# EAGLE design main board ver.1 (EAGLE 6.3)
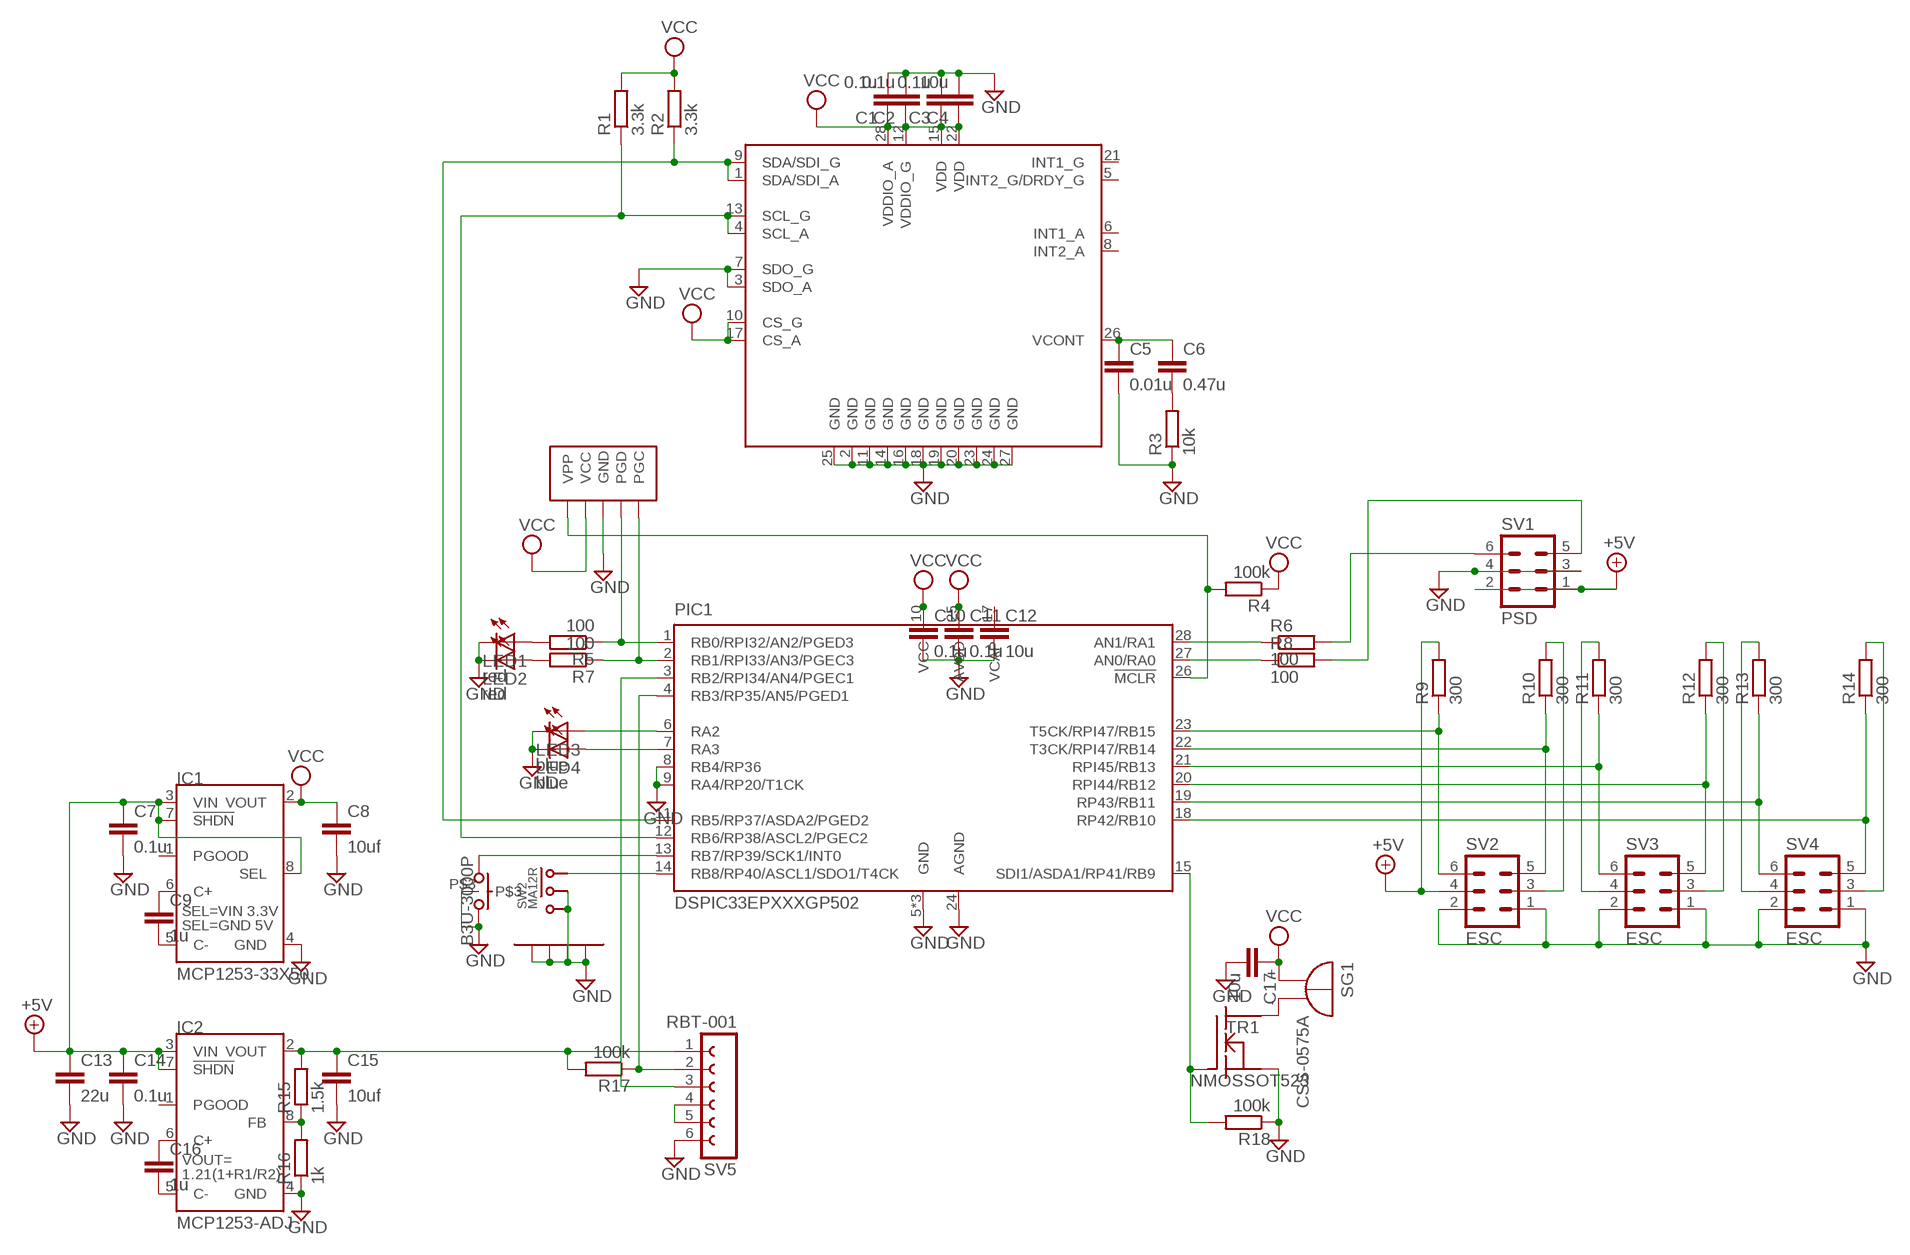
[diagram p0: schematic, sheet 1]

## Parts
C1  0.1u  C-EUC0402-SS  [C0402-SS]
C2  0.1u  C-EUC0402-SS  [C0402-SS]
C3  0.1u  C-EUC0402-SS  [C0402-SS]
C4  10u  C-EUC0805  [C0805]
C5  0.01u  C-EUC0402-SS  [C0402-SS]
C6  0.47u  C-EUC0402-SS  [C0402-SS]
C7  0.1u  C-EUC0402-SS  [C0402-SS]
C8  10uf  C-EUC0805  [C0805]
C9  1u  C-EUC0603  [C0603]
C10  0.1u  C-EUC0402-SS  [C0402-SS]
C11  0.1u  C-EUC0402-SS  [C0402-SS]
C12  10u  C-EUC0805  [C0805]
C13  22u  C-EUC1206  [C1206]
C14  0.1u  C-EUC0402-SS  [C0402-SS]
C15  10uf  C-EUC0805  [C0805]
C16  1u  C-EUC0603  [C0603]
C17  10u  C-EUC0805  [C0805]
IC1  MCP1253-33X50  [MSOP8]
IC2  MCP1253-ADJ  [MSOP8]
IMU1  LSM330DLRM  [LLGA28L(RM)]
LED1  red  LED1005  [CHIP-LED1005]
LED2  red  LED1005  [CHIP-LED1005]
LED3  blue  LED1005  [CHIP-LED1005]
LED4  blue  LED1005  [CHIP-LED1005]
PIC1  DSPIC33EPXXXGP502  [QFN28-ML_6X6MM]
R1  3.3k  R-EU_R0402-SS  [R0402-SS]
R2  3.3k  R-EU_R0402-SS  [R0402-SS]
R3  10k  R-EU_R0402-SS  [R0402-SS]
R4  100k  R-EU_R0402-SS  [R0402-SS]
R5  100  R-EU_R0402-SS  [R0402-SS]
R6  100  R-EU_R0402-SS  [R0402-SS]
R7  100  R-EU_R0402-SS  [R0402-SS]
R8  100  R-EU_R0402-SS  [R0402-SS]
R9  300  R-EU_R0402-SS  [R0402-SS]
R10  300  R-EU_R0402-SS  [R0402-SS]
R11  300  R-EU_R0402-SS  [R0402-SS]
R12  300  R-EU_R0402-SS  [R0402-SS]
R13  300  R-EU_R0402-SS  [R0402-SS]
R14  300  R-EU_R0402-SS  [R0402-SS]
R15  1.5k  R-EU_R0402-SS  [R0402-SS]
R16  1k  R-EU_R0402-SS  [R0402-SS]
R17  100k  R-EU_R0402-SS  [R0402-SS]
R18  100k  R-EU_R0402-SS  [R0402-SS]
SG1  CSS-0575A  [CSS-0575A]
SV1  PSD  MA03-2  [MA03-2]
SV2  ESC  MA03-2  [MA03-2]
SV3  ESC  MA03-2  [MA03-2]
SV4  ESC  MA03-2  [MA03-2]
SV5  RBT-001  FE06-1BFLC  [NPPN061BFLC]
SW1  B3U-3000P  [B3U-3000P]
SW2  MA12R  [MA12R]
TR1  NMOSSOT523  [SOT523]
U$1  ICSP  [MINI-ICSP]

## Nets
+5V: C7.1 C13.1 C14.1 IC1.3(VIN) IC1.7(!SHDN!) IC1.8(SEL) IC2.3(VIN) IC2.7(!SHDN!) R9.2 SV1.1 SV1.2 SV2.4
GND: C1.2 C2.2 C3.2 C4.2 C5.2 C7.2 C8.2 C10.2 C11.2 C12.2 C13.2 C14.2 C15.2 C17.2 IC1.4(GND) IC2.4(GND) IMU1.2(GND) IMU1.3(SDO_A) IMU1.7(SDO_G) IMU1.11(GND) IMU1.14(GND) IMU1.16(GND) IMU1.18(GND) IMU1.19(GND) IMU1.20(GND) IMU1.23(GND) IMU1.24(GND) IMU1.25(GND) IMU1.27(GND) LED1.C LED2.C LED3.C LED4.C PIC1.5(GND) PIC1.8(RB4/RP36) PIC1.9(RA4/RP20/T1CK) PIC1.16(GND) PIC1.24(AGND) PIC1.EXP(GND) R3.1 R16.1 R18.1 SV1.3 SV1.4 SV2.1 SV2.2 SV3.1 SV3.2 SV4.1 SV4.2 SV5.6 SW1.P$2 SW1.P$3 SW2.P$2 SW2.P$3 SW2.P$4 SW2.P$5 SW2.P$6 SW2.P$7 TR1.2(S) U$1.GND
N$2: C16.1 IC2.6(C+)
N$3: C16.2 IC2.5(C-)
N$4: PIC1.28(AN1/RA1) R6.1
N$5: PIC1.27(AN0/RA0) R8.1
N$6: C15.1 IC2.2(VOUT) R15.2 R17.2 SV5.1
N$7: IC2.8(FB) R15.1 R16.2
N$8: R8.2 SV1.5
N$9: C12.1 PIC1.17(VCAP)
N$10: PIC1.18(RP42/RB10) R14.1 SV4.5
N$11: C5.1 C6.1 IMU1.26(VCONT)
N$12: C6.2 R3.2
N$13: PIC1.19(RP43/RB11) R13.1 SV4.6
N$14: PIC1.20(RPI44/RB12) R12.1 SV3.5
N$15: IMU1.1(SDA/SDI_A) IMU1.9(SDA/SDI_G) PIC1.11(RB5/RP37/ASDA2/PGED2) R2.1
N$16: SG1.- TR1.3(D)
N$17: LED4.A PIC1.7(RA3)
N$18: PIC1.21(RPI45/RB13) R11.1 SV3.6
N$19: PIC1.22(T3CK/RPI47/RB14) R10.1 SV2.5
N$20: PIC1.23(T5CK/RPI47/RB15) R9.1 SV2.6
N$21: IMU1.4(SCL_A) IMU1.13(SCL_G) PIC1.12(RB6/RP38/ASCL2/PGEC2) R1.1
N$22: PIC1.15(SDI1/ASDA1/RP41/RB9) R18.2 TR1.1(G)
N$23: LED3.A PIC1.6(RA2)
N$24: LED1.A R5.2
N$25: PIC1.1(RB0/RPI32/AN2/PGED3) R5.1 U$1.PGD
N$26: PIC1.2(RB1/RPI33/AN3/PGEC3) R7.1 U$1.PGC
N$27: PIC1.3(RB2/RPI34/AN4/PGEC1) SV5.3
N$28: PIC1.4(RB3/RP35/AN5/PGED1) R17.1 SV5.2
N$29: LED2.A R7.2
N$30: PIC1.14(RB8/RP40/ASCL1/SDO1/T4CK) SW2.P$1
N$31: PIC1.13(RB7/RP39/SCK1/INT0) SW1.P$1
N$33: PIC1.26(!MCLR!) R4.2 U$1.VPP
N$35: R6.2 SV1.6
N$37: SV5.4 SV5.5
N$39: C9.1 IC1.6(C+)
N$40: C9.2 IC1.5(C-)
N$67: R10.2 SV2.3
N$68: R11.2 SV3.4
N$69: R12.2 SV3.3
N$70: R13.2 SV4.4
N$71: R14.2 SV4.3
VCC: C1.1 C2.1 C3.1 C4.1 C8.1 C10.1 C11.1 C17.1 IC1.2(VOUT) IMU1.10(CS_G) IMU1.12(VDDIO_G) IMU1.15(VDD) IMU1.17(CS_A) IMU1.22(VDD) IMU1.28(VDDIO_A) PIC1.10(VCC) PIC1.25(AVDD) R1.2 R2.2 R4.1 SG1.+ U$1.VCC
Unconnected: IC1.1(PGOOD) IC2.1(PGOOD) IMU1.5(INT2_G/DRDY_G) IMU1.6(INT1_A) IMU1.8(INT2_A) IMU1.21(INT1_G)

## Library data of the parts
C1-C17 = 2 RCL:C-EU: CAPACITOR, European symbol
IC1 = 0 my parts:MCP1253-33X50
IC2 = 0 my parts:MCP1253-ADJ
IMU1 = 0 my parts:LSM330DL
LED1-LED4 = 0 my parts:LED: LED OSRAM: - CHIPLED LG R971, LG N971, LY N971, LG Q971, LY Q971, LO R971, LY R971 LH N974, LH R974 LS Q976, LO Q976, LY Q976 LO Q996 - Hyper CHIPLED LW Q18S LB Q993, LB Q99A, LB R99A - SideLED LS A670, LO A670, LY A670, LG A670, LP A670 LB A673, LV A673, LT A673, LW A673 LH A674 LY A675 LS A676, LA A676, LO A676, LY A676, LW A676 LS A679, LY A679, LG A679 - Hyper Micro SIDELED® LS Y876, LA Y876, LO Y876, LY Y876 LT Y87S - SmartLED LW L88C, LW L88S LB L89C, LB L89S, LG L890 LS L89K, LO L89K, LY L89K LS L896, LA L896, LO L896, LY L896 - TOPLED LS T670, LO T670, LY T670, LG T670, LP T670 LSG T670, LSP T670, LSY T670, LOP T670, LYG T670 LG T671, LOG T671, LSG T671 LB T673, LV T673, LT T673, LW T673 LH T674 LS T676, LA T676, LO T676, LY T676, LB T676, LH T676, LSB T676, LW T676 LB T67C, LV T67C, LT T67C, LS T67K, LO T67K, LY T67K, LW E67C LS E67B, LA E67B, LO E67B, LY E67B, LB E67C, LV E67C, LT E67C LW T67C LS T679, LY T679, LG T679 LS T770, LO T770, LY T770, LG T770, LP T770 LB T773, LV T773, LT T773, LW T773 LH T774 LS E675, LA E675, LY E675, LS T675 LS T776, LA T776, LO T776, LY T776, LB T776 LHGB T686 LT T68C, LB T68C - Hyper Mini TOPLED® LB M676 - Mini TOPLED Santana® LG M470 LS M47K, LO M47K, LY M47K Source: http://www.osram.convergy.de - LUMILED® LXK2-PW12-R00, LXK2-PW12-S00, LXK2-PW14-U00, LXK2-PW14-V00 LXK2-PM12-R00, LXK2-PM12-S00, LXK2-PM14-U00 LXK2-PE12-Q00, LXK2-PE12-R00, LXK2-PE12-S00, LXK2-PE14-T00, LXK2-PE14-U00 LXK2-PB12-K00, LXK2-PB12-L00, LXK2-PB12-M00, LXK2-PB14-N00, LXK2-PB14-P00, LXK2-PB14-Q00 LXK2-PR12-L00, LXK2-PR12-M00, LXK2-PR14-Q00, LXK2-PR14-R00 LXK2-PD12-Q00, LXK2-PD12-R00, LXK2-PD12-S00 LXK2-PH12-R00, LXK2-PH12-S00 LXK2-PL12-P00, LXK2-PL12-Q00, LXK2-PL12-R00 Source: www.luxeon.com
PIC1 = 0 my parts:DSPIC33EPXXXGP502
R1-R18 = 2 RCL:R-EU_: RESISTOR, European symbol
SG1 = 8 BUZZER:CSS-0575A
SV1-SV4 = 4 _l__l_:MA03-2: PIN HEADER
SV5 = 4 _ll_ll_:FE06-1: FEMALE HEADER
SW1 = 0 my parts:B3U
SW2 = 0 my parts:MA12R
TR1 = 0 my parts:NMOS
U$1 = 0 my parts:ICSP

## Board
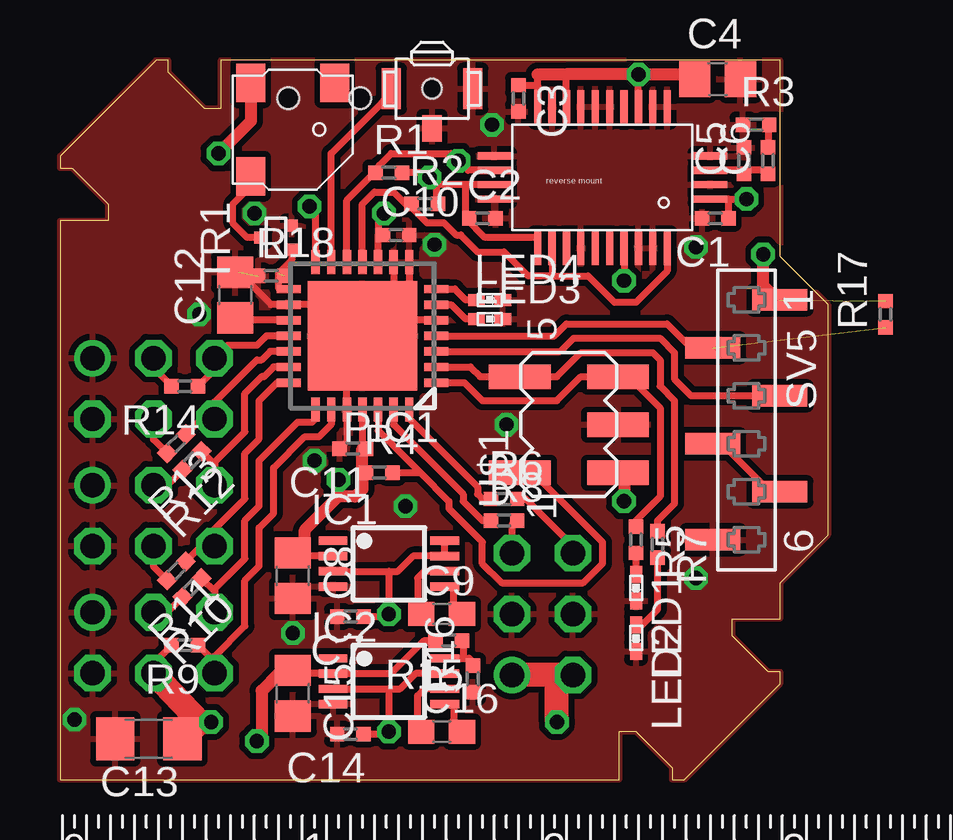
[diagram p1: board, top side]
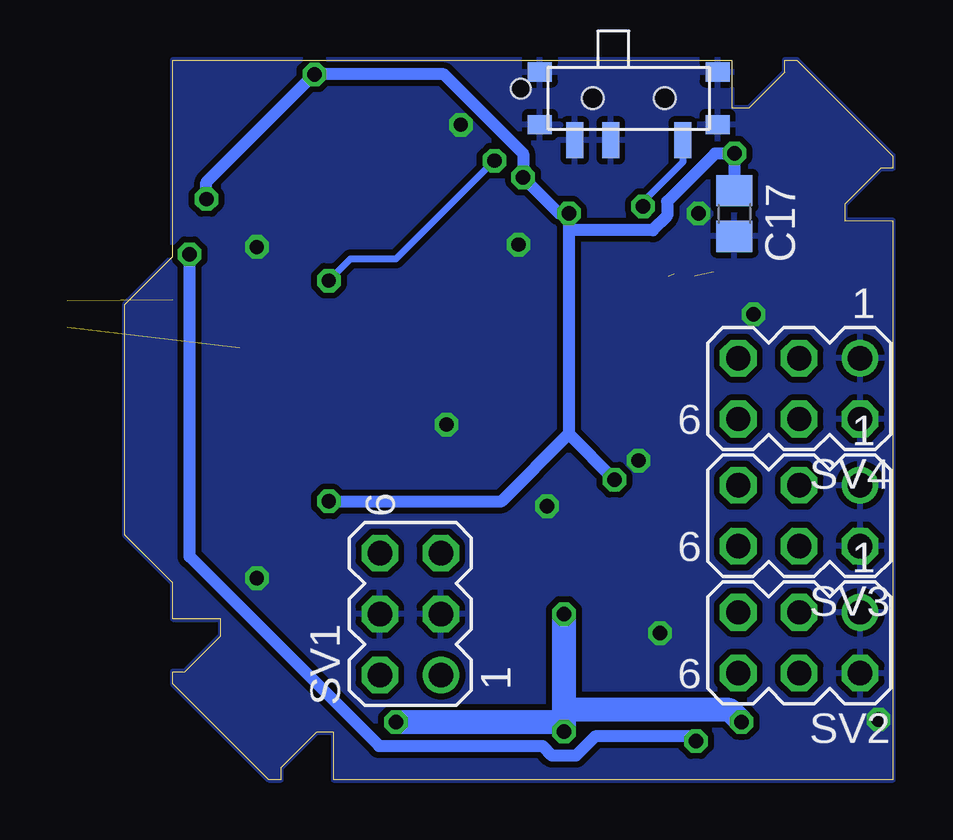
[diagram p2: board, bottom side, seen from below]

Size 32 x 30 mm. Coordinates in mm from the lower left corner, seen from the top.
Outline: 0,0 23.3,0 23.3,2 24,2 25.5,0.5 25.5,0 26,0 30,4 30,4.5 29.5,4.5 28,6 28,6.7 30,6.7 30,8.2 32,10.2 32,19.8 30,21.8 30,30 6.7,30 6.7,28 6,28 4.5,29.5 4.5,30 4,30 0,26 0,25.5 0.5,25.5 2,24 2,23.3 0,23.3 0,0
Copper layers (1*16): Top 0.035mm / dielectric 1.5mm / Bottom 0.035mm
Design rules "default": minimum track width 0.25mm, minimum drill 0.6mm, track to track 0.25mm, track to pad 0.25mm, pad to pad 0.25mm, via to via 0.25mm, smd to smd 0mil, copper to edge 0mil, drill to drill 8mil, minimum pad ring 10mil, minimum via ring 0.19mm, stop-mask expansion 4mil, vias tented up to drill 0mil, thermal gap 10mil

### Footprints (pad centres in the part's own frame; a part is rotated, then mirrored left to right if it is on the bottom)
C0402-SS = smd 0.6 x 0.6: 1 -0.55,0; 2 0.55,0
C0805 = smd 1.3 x 1.5: 1 -0.95,0; 2 0.95,0
C0603 = smd 1.1 x 1: 1 -0.85,0; 2 0.85,0
C1206 = smd 1.6 x 1.8: 1 -1.4,0; 2 1.4,0
MSOP8 = smd 0.35 x 1.2: 1 -0.953,-2.325; 2 -0.318,-2.325; 3 0.318,-2.325; 4 0.953,-2.325; 5 0.953,2.325; 6 0.318,2.325; 7 -0.318,2.325; 8 -0.953,2.325
LLGA28L(RM) = smd 0.3 x 1.4: 1 -2.7,2.95; 2 -2.1,2.95; 3 -1.5,2.95; 4 -0.9,2.95; 5 -0.3,2.95; 6 0.3,2.95; 7 0.9,2.95; 8 1.5,2.95; 9 2.1,2.95; 10 2.7,2.95; 15 2.7,-2.95; 16 2.1,-2.95; 17 1.5,-2.95; 18 0.9,-2.95; 19 0.3,-2.95; 20 -0.3,-2.95; 21 -0.9,-2.95; 22 -1.5,-2.95; 23 -2.1,-2.95; 24 -2.7,-2.95 | smd 1.4 x 0.3: 11 4.5,0.9; 12 4.5,0.3; 13 4.5,-0.3; 14 4.5,-0.9; 25 -4.5,-0.9; 26 -4.5,-0.3; 27 -4.5,0.3; 28 -4.5,0.9
CHIP-LED1005 = smd 0.5 x 0.7: A 0,-0.55; C 0,0.55
QFN28-ML_6X6MM = smd 1 x 0.35: 1 -3.075,1.95; 2 -3.075,1.3; 3 -3.075,0.65; 4 -3.075,0; 5 -3.075,-0.65; 6 -3.075,-1.3; 7 -3.075,-1.95; 15 3.075,-1.95; 16 3.075,-1.3; 17 3.075,-0.65; 18 3.075,0; 19 3.075,0.65; 20 3.075,1.3; 21 3.075,1.95 | smd 0.35 x 1: 8 -1.95,-3.075; 9 -1.3,-3.075; 10 -0.65,-3.075; 11 0,-3.075; 12 0.65,-3.075; 13 1.3,-3.075; 14 1.95,-3.075; 22 1.95,3.075; 23 1.3,3.075; 24 0.65,3.075; 25 0,3.075; 26 -0.65,3.075; 27 -1.3,3.075; 28 -1.95,3.075 | smd 4.55 x 4.55: EXP 0,0
R0402-SS = smd 0.6 x 0.6: 1 -0.55,0; 2 0.55,0
CSS-0575A = smd 1.6 x 1.2: + -1.95,-1.75; - 1.95,-1.75; NC -1.95,1.75
MA03-2 = drill 1.016: 1 -2.54,-1.27 | drill 1.016 octagon: 2 -2.54,1.27; 3 0,-1.27; 4 0,1.27; 5 2.54,-1.27; 6 2.54,1.27
NPPN061BFLC = smd 0.89 x 2.29: 1 -5,1.395; 2 -3,-1.395; 3 -1,1.395; 4 1,-1.395; 5 3,1.395; 6 5,-1.395
B3U-3000P = smd 0.8 x 1.7: P$1 -1.7,0; P$2 1.7,0 | smd 0.8 x 1.1: P$3 0,-1.65 | hole 0.8: 0,0
MA12R = smd 0.7 x 1.5: P$1 -2.25,1.75; P$2 0.75,1.75; P$3 2.25,1.75 | smd 1 x 0.8: P$4 -3.7,1.1; P$5 -3.7,-1.1; P$6 3.7,-1.1; P$7 3.7,1.1 | hole 0.9: -1.5,0; 1.5,0
SOT523 = smd 0.5 x 0.5: 1 -0.5,-0.65; 2 0.5,-0.65; 3 0,0.65
MINI-ICSP = smd 1 x 2.6: GND 0,-2.05; PGC 2,2.05; PGD 2,-2.05; VCC -2,-2.05; VPP -2,2.05

### Placement (x,y rotation side)
C1  27.3,23.4 180 top
C2  17.6,23.4 0 top
C3  19.1,28.4 270 top
C4  27.4,29.2 0 top
C5  28.5,25.8 90 top
C6  29.5,25.8 90 top
C7  12.1,6.8 180 top
C8  9.7,8.5 270 top
C9  15.9,6.9 0 top
C10  14,22.7 0 top
C11  12.2,13.8 180 top
C12  7.3,20.2 90 top
C13  3.7,1.7 180 top
C14  12.1,1.9 180 top
C15  9.7,3.6 270 top
C16  15.9,2 0 top
C17  6.6,23.6 270 bottom
IC1  13.7,9 270 top
IC2  13.7,4.1 270 top
IMU1  22.6,25.1 180 top
LED1  24,8 180 top
LED2  24,5.9 180 top
LED3  17.9,19.2 270 top
LED4  17.9,20 270 top
PIC1  12.6,18.5 180 top
R1  13.7,25.3 0 top
R2  15.2,24 0 top
R3  29,27.3 0 top
R4  13.3,12.8 0 top
R5  24,10 270 top
R6  18.5,11.7 0 top
R7  24.9,9.8 270 top
R8  18.5,10.8 0 top
R9  5.2,5.6 180 top
R10  5.5,8 225 top
R11  4.85,8.7 225 top
R12  5.5,13.3 225 top
R13  4.85,14 225 top
R14  5.2,16.4 180 top
R15  16.2,5.8 180 top
R16  17.2,4.2 90 top
R17  34.4,19.4 90 top
R18  8.8,21 0 top
SG1  9.7,27.1 270 top
SV1  20.1,6.9 90 bottom
SV2  3.9,5.7 180 bottom
SV3  3.9,11 180 bottom
SV4  3.9,16.3 180 bottom
SV5  28.6,15 270 top
SW1  15.5,28.8 0 top
SW2  11,28.4 180 bottom
TR1  9,22.6 90 top
U$1  21.2,14.8 90 top
U$2  [RULER-S]  0.1,-4.5 0 top  (outside the outline)

### Tracks (layer width: path | path; a pad name or v marks a point on that pad's centre or on a via)
+5V  (via drill 0.6)
  Top 0.3: IC2.3 13.7,3.78 | 13.7,3.78 v13.7,2 13.6,1.9 C14.1 | IC1.3 13.7,8.68 | 13.7,8.68 v13.7,6.9 13.6,6.8 C7.1 | IC1.8 IC1.7 14.72,9.32 14.08,8.68 13.7,8.68 | IC2.7 14.82,4.42 14.18,3.78 13.7,3.78 | R9.2 3.9,4.85 SV2.4
  Top 1: SV1.2 20.7,4.36 | SV2.4 5.83,2.4 | 5.83,2.4 v6.3,2.4 | C13.1 5.13,1.7 5.83,2.4 | v20.7,2.4 20.7,4.36 | 20.7,4.36 SV1.1 18.8,4.36
  Bottom 1: v6.3,2.4 6.8,2.9 13.7,2.9 | v13.7,6.9 13.7,2.9 | 13.7,2.9 13.7,2.4 | v20.7,2.4 13.7,2.4 | 13.7,2.4 v13.7,2
GND  (via drill 0.6)  (1 unrouted)
  Top 0.3: C11.2 11.95,14.1 PIC1.24 11.95,17.85 PIC1.EXP | PIC1.EXP 11.3,19.8 PIC1.16 8.8,19.8 7.45,21.15 C12.2 | PIC1.5 13.25,19.15 PIC1.EXP | PIC1.9 13.9,19.8 PIC1.EXP | PIC1.8 14.55,20.45 PIC1.EXP
  other vias: 10.6,13.3 18.6,14.8 15.6,22.3 14.4,11.4 0.6,2.5 8.1,23.6 26.5,8.4 9.7,6.1 5.8,19.4 18,27.3 26.5,22.2
  pour Bottom: 2,23.3 2,24 0.5,25.5 0,25.5 0,26 4,30 4.5,30 4.5,29.5 6,28 6.7,28 6.7,30 30,30 30,21.8 32,19.8 32,10.2 30,8.2 30,6.7 28,6.7 28,6 29.5,4.5 30,4.5 30,4 26,0 25.5,0 25.5,0.5 24,2 23.3,2 23.3,0 0,0 0,23.3
  pour Top: 2,23.3 2,24 0.5,25.5 0,25.5 0,26 4,30 4.5,30 4.5,29.5 6,28 6.7,28 6.7,30 30,30 30,21.8 32,19.8 32,10.2 30,8.2 30,6.7 28,6.7 28,6 29.5,4.5 30,4.5 30,4 26,0 25.5,0 25.5,0.5 24,2 23.3,2 23.3,0 0,0 0,23.3
N$2
  Top 0.3: IC2.6 15.18,3.78 14.9,3.5 14.9,2.15 C16.1
N$3
  Top 0.3: IC2.5 16.4,3.15 16.4,2.5 16.4,2.3 16.4,2 C16.2
N$4
  Top 0.3: PIC1.28 14.55,15.05 17.4,12.2 17.4,11.9 17.6,11.7 R6.1
N$5
  Top 0.3: PIC1.27 13.9,14.8 16.8,11.9 16.8,11.6 17.6,10.8 R8.1
N$6  (via drill 0.6)  (1 unrouted)
  Top 0.3: C15.1 9.7,4.42 IC2.2 13.8,4.42 15.18,5.8 R15.2
  Top 0.5: 9.7,4.42 9.12,4.42 8.4,3.7 8.4,1.8 v8.2,1.6 | SV5.1 29.9,20 29.3,20.6 v29.3,21.9
  Bottom 0.5: v29.3,21.9 29.3,9.3 21.4,1.4 14.6,1.4 14.2,1 13.2,1 12.4,1.8 8.4,1.8 v8.2,1.6
N$7
  Top 0.3: IC2.8 16.8,5.05 | 16.8,5.05 17.05,5.05 17.2,4.9 R16.2 | R15.1 16.8,5.75 16.8,5.05
N$8
  Top 0.3: R8.2 19,10.8 18.83,10.63 SV1.5
N$9
  Top 0.3: PIC1.17 7.3,19.15 C12.1
N$10
  Top 0.3: PIC1.18 8.6,18.5 8.2,18.1 6.97,18.1 SV4.5 6.44,17.09 R14.1
N$11
  Top 0.3: 28.5,25.4 C5.1 | C6.1 29.5,25.4 28.5,25.4 | 28.5,25.4 IMU1.26
N$12
  Top 0.3: R3.2 29.5,27.3 C6.2
N$13
  Top 0.3: PIC1.19 8.75,17.85 8.4,17.5 8.2,17.5 6.44,15.74 SV4.6 5.88,15.03 R13.1
N$14
  Top 0.3: PIC1.20 8.9,17.2 8.5,16.8 8.4,16.8 7.7,16.1 7.7,14.5 6.44,13.24 6.44,13.14 | R12.1 6.44,13.14 | 6.44,13.14 SV3.5
N$15
  Top 0.3: IMU1.9 20.5,21 | PIC1.11 12.6,24 13.1,24.5 13.9,24.5 14.4,24 R2.1 14.65,23.85 15.3,23.2 16,23.2 16.5,22.7 16.7,22.7 17.4,22 18.5,22 19.5,21 20.5,21 | 20.5,21 22,21 23.1,19.9 24,19.9 25.3,21.2 IMU1.1
N$16
  Top 0.3: TR1.3 7.8,22.6 7.2,23.2 7.2,24 8.15,24.95 SG1.-
N$17
  Top 0.3: PIC1.7 16.45,20.45 16.9,20 LED4.A
N$18
  Top 0.3: PIC1.21 9.05,16.55 8.3,15.8 8.3,14.2 7.7,13.6 7.7,11.7 6.44,10.44 SV3.6 | 6.44,10.21 SV3.6 | R11.1 5.88,9.73 SV3.6
N$19
  Top 0.3: PIC1.22 10.65,15.05 10.5,14.9 9.9,14.9 8.3,13.3 8.3,11.4 7.7,10.8 7.7,9.2 6.44,7.94 6.44,7.84 | R10.1 6.44,7.84 | 6.44,7.84 SV2.5
N$20
  Top 0.3: PIC1.23 11.3,14.8 10.8,14.3 10.2,14.3 8.9,13 8.9,11.1 8.3,10.5 8.3,8.9 7.7,8.3 7.7,6.4 6.44,5.14 6.44,4.91 | 6.44,4.91 SV2.6 | R9.1 6.44,4.91
N$21  (via drill 0.6)
  Top 0.3: IMU1.4 v23.5,20.8 | IMU1.13 17,25.4 v16.6,25.8 16.3,26.1 13.8,26.1 13.3,25.6 13.3,25.4 13.2,25.3 R1.1 13.1,25.3 11.95,24.15 PIC1.12
  Bottom 0.3: v23.5,20.8 22.6,21.7 20.7,21.7 v16.6,25.8
N$22  (1 unrouted)
  Top 0.3: PIC1.15 9.15,20.45 9.1,20.5 9.1,21.1 9.65,21.65 TR1.1
N$23
  Top 0.3: PIC1.6 16.3,19.8 16.9,19.2 LED3.A
N$24
  Top 0.3: LED1.A R5.2
N$25
  Top 0.3: PIC1.1 16.85,16.55 17.6,15.8 20.7,15.8 21.7,16.8 U$1.PGD 23.9,16.8 23.9,16.6 25,15.5 25,11.8 24,10.8 R5.1
N$26
  Top 0.3: PIC1.2 17.1,17.2 17.5,16.8 U$1.PGC 20.7,16.8 21.7,17.8 24.7,17.8 25,17.5 25,16.4 25.6,15.8 25.6,11.5 24.9,10.8 R7.1
N$27
  Top 0.3: PIC1.3 20.85,17.85 21.4,18.4 25,18.4 25.6,17.8 25.6,16.7 26.3,16 SV5.3
N$28  (1 unrouted)
  Top 0.3: PIC1.4 20.6,18.5 21.1,19 25.3,19 26.3,18 SV5.2
N$29
  Top 0.3: LED2.A 24.25,6.45 24.9,7.1 R7.2
N$30  (via drill 0.6)
  Top 0.3: PIC1.14 10.65,23.65 v10.4,23.9
  Bottom 0.3: SW2.P$1 8.75,25.75 10.4,24.1 v10.4,23.9
N$31
  Top 0.3: PIC1.13 11.3,26.1 13.4,28.2 SW1.P$1
N$33
  Top 0.3: PIC1.26 13.25,14.55 15,12.8 | R4.2 15,12.8 | 15,12.8 16.2,11.6 16.2,11.3 17.6,9.9 17.6,9 18.4,8.2 21.8,8.2 22.6,9 22.6,9.9 19.7,12.8 U$1.VPP
N$35
  Top 0.3: R6.2 19.4,11.7 21.37,9.73 SV1.6
N$37
  Top 0.3: SV5.4 27.6,14 29.6,12 SV5.5
N$39
  Top 0.3: IC1.6 15.18,8.68 14.9,8.4 14.9,7.05 C9.1
N$40
  Top 0.3: IC1.5 16.4,8.05 16.4,6.9 C9.2
N$67
  Top 0.3: R10.2 4.47,6.97 SV2.3
N$68
  Top 0.3: R11.2 3.9,8.87 SV3.4
N$69
  Top 0.3: R12.2 4.47,12.27 SV3.3
N$70
  Top 0.3: R13.2 3.9,14.17 SV4.4
N$71
  Top 0.3: R14.2 3.9,17.15 SV4.3
VCC  (via drill 0.6)
  Top 0.3: PIC1.25 12.6,13.95 C11.1 12.6,13.8 | IMU1.17 21.1,29.4 | IMU1.15 19.9,29.4 | C1.1 27.85,24.2 IMU1.28 v28.6,24.2 | IMU1.22 v24.1,29.4 | C3.1 19.9,28.95 IMU1.15 | 19.9,27.8 IMU1.15 | IMU1.12 16.9,24.8 | 16.9,24.8 15.7,24.8 | 15.7,24.8 v15.4,25.1 15.2,25.3 R1.2 | IC1.2 10.2,9.32 | C2.1 16.9,23.4 | 16.9,23.4 16.9,24.8 | 26.45,29.4 C4.1 | IMU1.10 19.9,22.6 17.7,22.6 16.9,23.4 | PIC1.10 13.25,22.7 | 13.25,22.7 C10.1 | v13.5,23.6 13.25,23.35 13.25,22.7 | R2.2 15.7,24 15.7,24.8
  Top 0.5: 19.9,29.4 21.1,29.4 v24.1,29.4 26.45,29.4 | 10.2,9.32 10.2,9.8 | 10.2,9.8 9.7,9.8 C8.1 | 10.2,9.8 10.2,10.4 11.6,11.8 | R4.1 12.6,12.8 | 12.6,12.8 12.6,13.8 | U$1.VCC 23.5,12.55 v23.5,11.6 | SG1.+ 7.95,27.45 v6.6,26.1 | 11.6,11.8 v11.6,12.5 | 11.6,11.8 12.3,11.8 12.6,12.1 12.6,12.8
  Bottom 0.5: 13.5,22.9 v13.5,23.6 13.9,23.6 v15.4,25.1 15.4,26.1 18.7,29.4 v24.1,29.4 28.6,24.9 v28.6,24.2 | 13.5,22.9 10,22.9 9.4,23.5 9.4,24.1 7.4,26.1 v6.6,26.1 C17.1 | 13.5,22.9 13.5,14.4 | 13.5,14.4 v11.6,12.5 | v23.5,11.6 16.3,11.6 13.5,14.4